# EAGLE design V1 (EAGLE 7.6.0)
Tek 7904A LED graticule illumination mod
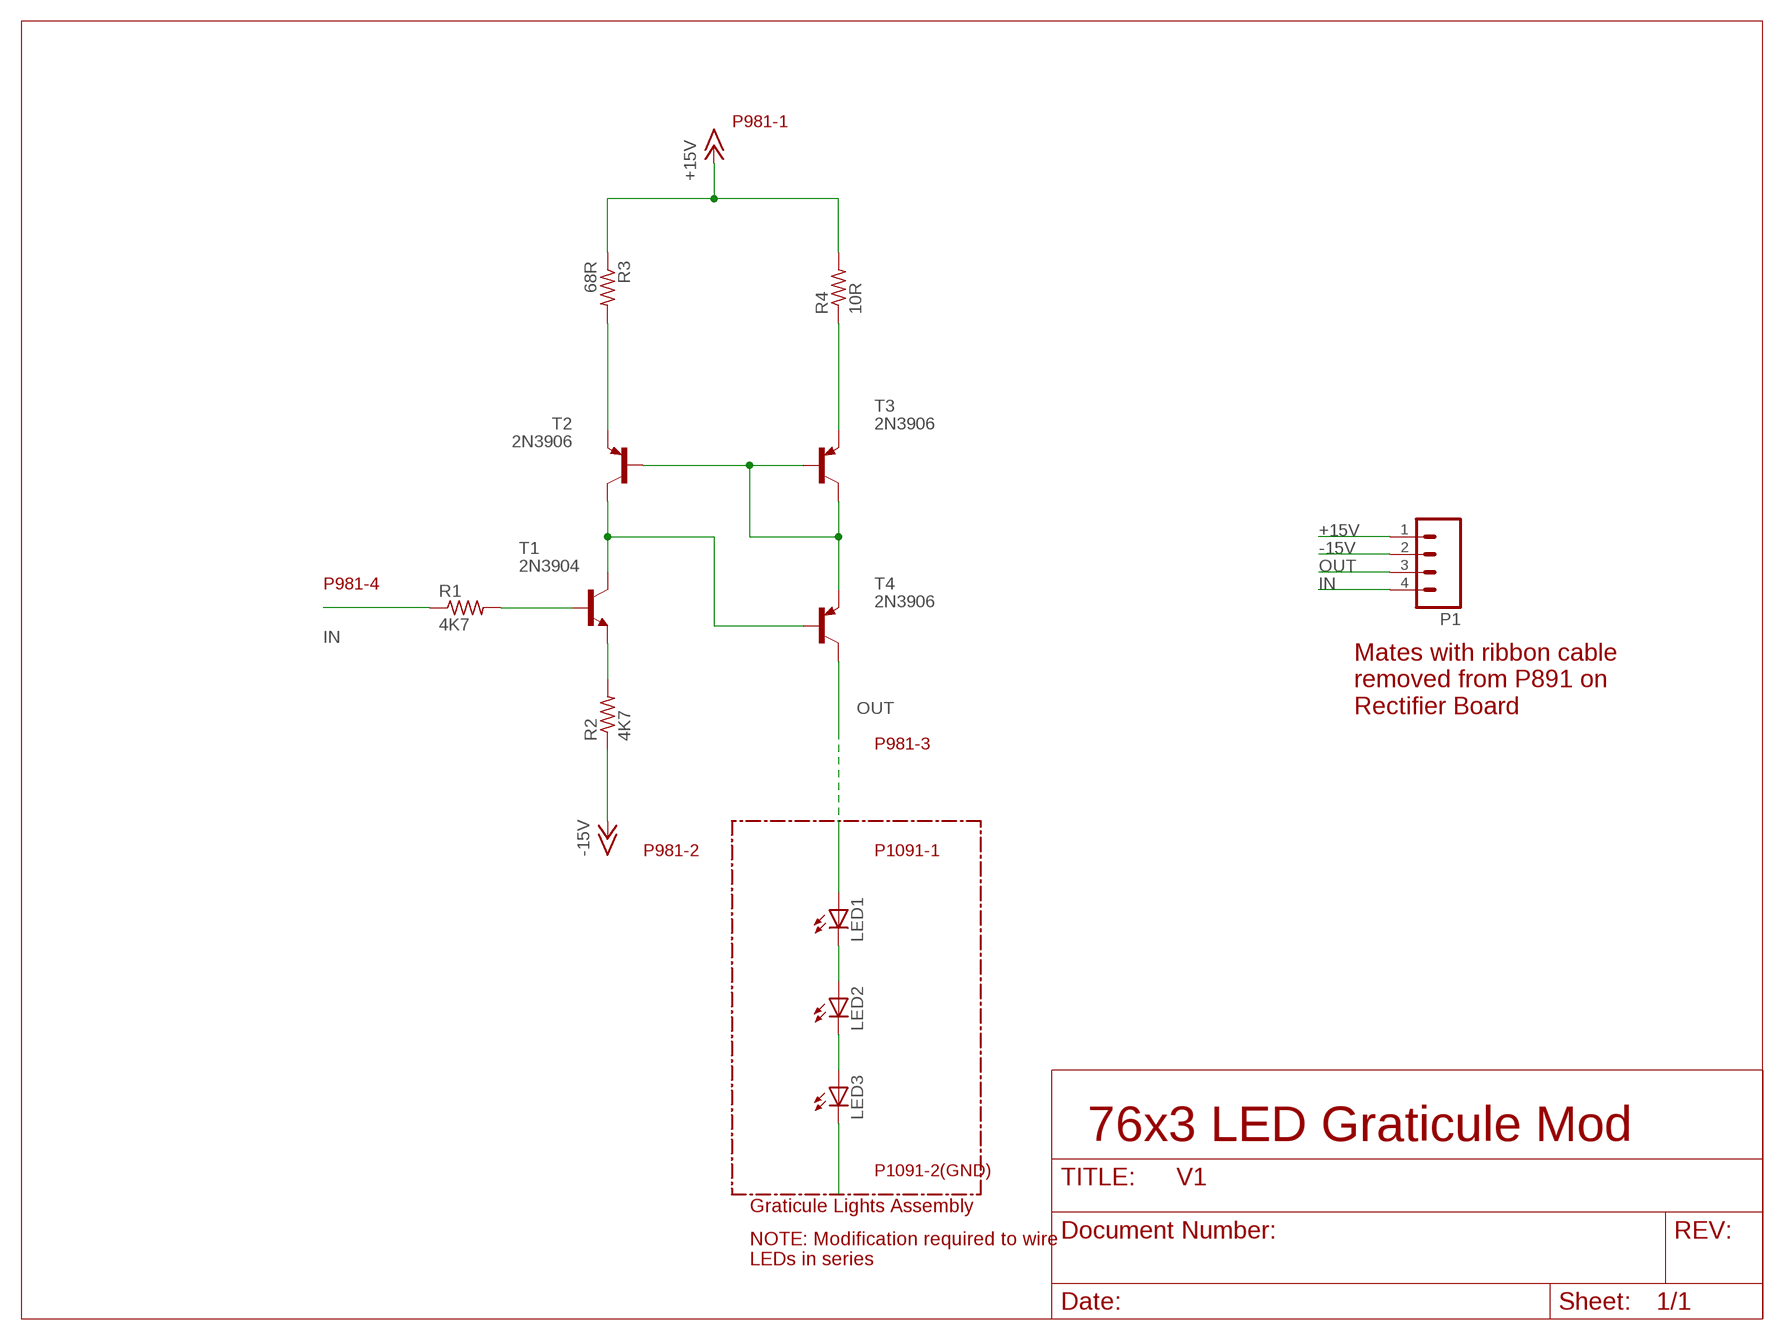
[diagram p0: schematic, sheet 1]

## Parts
LED1  LED5MM  [LED5MM]
LED2  LED5MM  [LED5MM]
LED3  LED5MM  [LED5MM]
P1  M04PTH  [1X04]
R1  4K7  R-US_0309/V  [0309V]
R2  4K7  R-US_0309/V  [0309V]
R3  68R  R-US_0309/V  [0309V]
R4  10R  R-US_0309/V  [0309V]
T1  2N3904  -NPN-TO92-EBC  [TO92-EBC]
T2  2N3906  BC328-PNP-TO92-EBC  [TO92-EBC]
T3  2N3906  BC328-PNP-TO92-EBC  [TO92-EBC]
T4  2N3906  BC328-PNP-TO92-EBC  [TO92-EBC]

## Nets
+15V [Supply]: P1.1 R3.1 R4.2
-15V: P1.2 R2.1
IN: P1.4 R1.1
N$1: R1.2 T1.B
N$2: LED3.K(C)
N$3: R2.2 T1.E
N$5: R3.2 T2.E
N$7: LED2.K(C) LED3.A
N$8: LED1.K(C) LED2.A
N$9: LED1.A
N$10 [Supply]: R4.1 T3.E
N$11 [Supply]: T2.B T3.B T3.C T4.E
N$13: T1.C T2.C T4.B
OUT [Supply]: P1.3 T4.C

## Notes on the sheet
- P981-1
- P981-4
- Mates with ribbon cable
  removed from P891 on
  Rectifier Board
- P981-3
- P981-2 | P1091-1
- 76x3 LED Graticule Mod
- P1091-2(GND)
- Graticule Lights Assembly
- NOTE: Modification required to wire
  LEDs in series

## Library data of the parts
LED1-LED3 = led:LED: LED OSRAM: - CHIPLED LG R971, LG N971, LY N971, LG Q971, LY Q971, LO R971, LY R971 LH N974, LH R974 LS Q976, LO Q976, LY Q976 LO Q996 - Hyper CHIPLED LW Q18S LB Q993, LB Q99A, LB R99A - SideLED LS A670, LO A670, LY A670, LG A670, LP A670 LB A673, LV A673, LT A673, LW A673 LH A674 LY A675 LS A676, LA A676, LO A676, LY A676, LW A676 LS A679, LY A679, LG A679 - Hyper Micro SIDELED® LS Y876, LA Y876, LO Y876, LY Y876 LT Y87S - SmartLED LW L88C, LW L88S LB L89C, LB L89S, LG L890 LS L89K, LO L89K, LY L89K LS L896, LA L896, LO L896, LY L896 - TOPLED LS T670, LO T670, LY T670, LG T670, LP T670 LSG T670, LSP T670, LSY T670, LOP T670, LYG T670 LG T671, LOG T671, LSG T671 LB T673, LV T673, LT T673, LW T673 LH T674 LS T676, LA T676, LO T676, LY T676, LB T676, LH T676, LSB T676, LW T676 LB T67C, LV T67C, LT T67C, LS T67K, LO T67K, LY T67K, LW E67C LS E67B, LA E67B, LO E67B, LY E67B, LB E67C, LV E67C, LT E67C LW T67C LS T679, LY T679, LG T679 LS T770, LO T770, LY T770, LG T770, LP T770 LB T773, LV T773, LT T773, LW T773 LH T774 LS E675, LA E675, LY E675, LS T675 LS T776, LA T776, LO T776, LY T776, LB T776 LHGB T686 LT T68C, LB T68C - Hyper Mini TOPLED® LB M676 - Mini TOPLED Santana® LG M470 LS M47K, LO M47K, LY M47K Source: http://www.osram.convergy.de LUXEON: - LUMILED® LXK2-PW12-R00, LXK2-PW12-S00, LXK2-PW14-U00, LXK2-PW14-V00 LXK2-PM12-R00, LXK2-PM12-S00, LXK2-PM14-U00 LXK2-PE12-Q00, LXK2-PE12-R00, LXK2-PE12-S00, LXK2-PE14-T00, LXK2-PE14-U00 LXK2-PB12-K00, LXK2-PB12-L00, LXK2-PB12-M00, LXK2-PB14-N00, LXK2-PB14-P00, LXK2-PB14-Q00 LXK2-PR12-L00, LXK2-PR12-M00, LXK2-PR14-Q00, LXK2-PR14-R00 LXK2-PD12-Q00, LXK2-PD12-R00, LXK2-PD12-S00 LXK2-PH12-R00, LXK2-PH12-S00 LXK2-PL12-P00, LXK2-PL12-Q00, LXK2-PL12-R00 Source: www.luxeon.com KINGBRIGHT: KA-3528ASYC Source: www.kingbright.com
P1 = SparkFun-Connectors:M04: Header 4 Standard 4-pin 0.1" header. Use with straight break away headers (SKU : PRT-00116), right angle break away headers (PRT-00553), swiss pins (PRT-00743), machine pins (PRT-00117), and female headers (PRT-00115). Molex polarized connector foot print use with SKU : PRT-08231 with associated crimp pins and housings. 1MM SMD Version SKU: PRT-10208
R1-R4 = rcl:R-US_: RESISTOR, American symbol
T1 = transistor:*-NPN-: NPN Transistror BF959 corrected 2008.03.06
T2-T4 = transistor:*-PNP-: PNP Transistror

## Net classes
1 Supply: width 0.508 mm

## Board
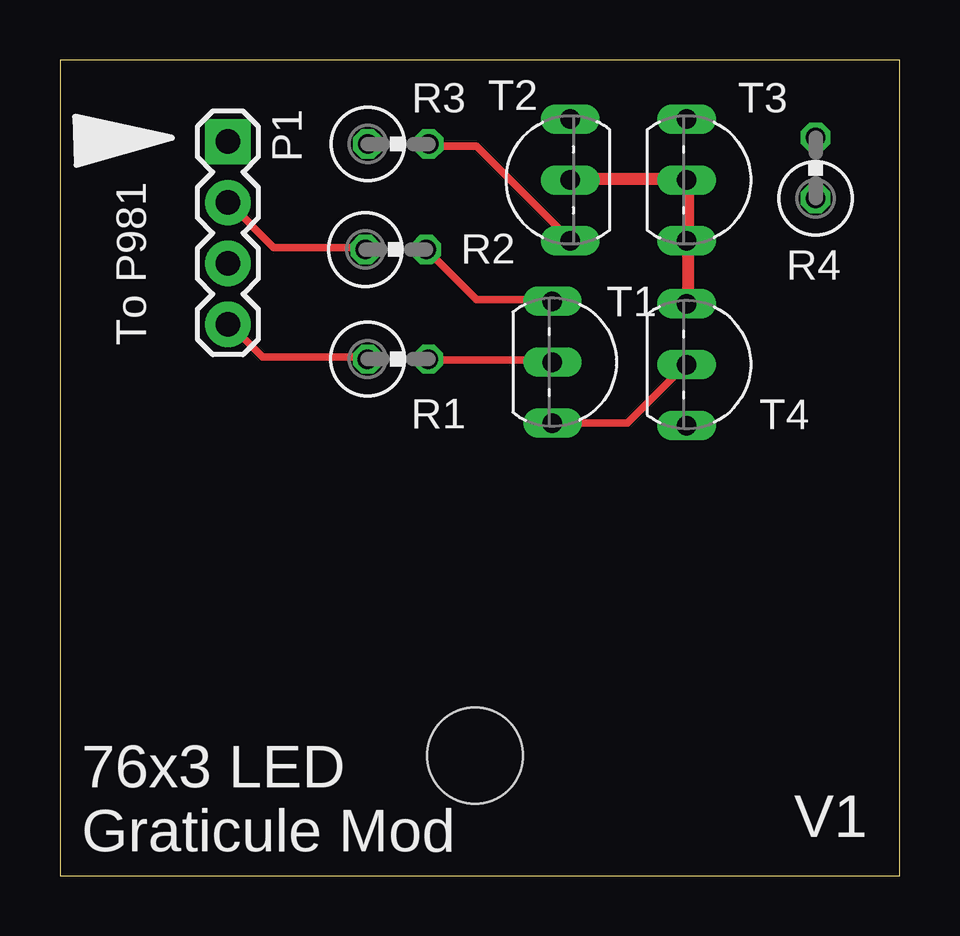
[diagram p1: board, top side]
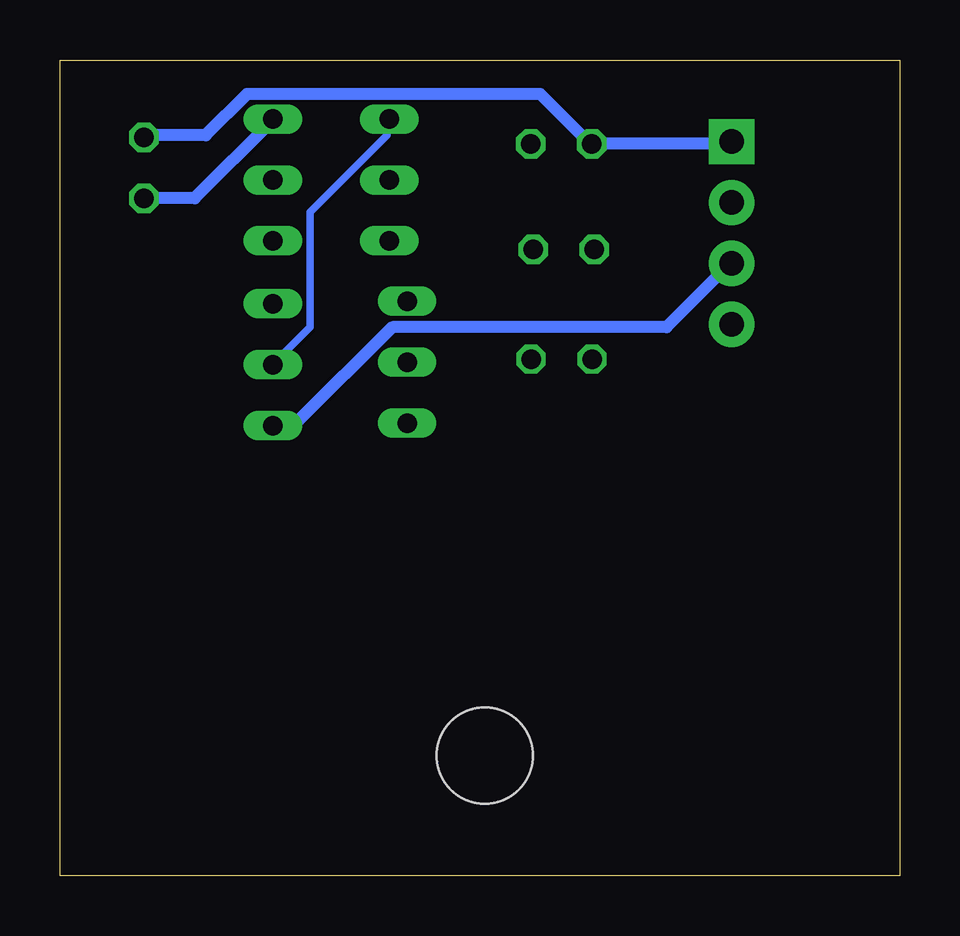
[diagram p2: board, bottom side, seen from below]

Size 35 x 34 mm. Coordinates in mm from the lower left corner, seen from the top.
Outline: 0,0 35,0 35,34 0,34 0,0
Copper layers (1*16): Top 0.035559375mm / dielectric 1.6mm / Bottom 0.035559375mm
Design rules "oshpark-2layer *": minimum track width 12mil, minimum drill 10mil, track to track 6mil, track to pad 6mil, pad to pad 6mil, via to via 6mil, smd to smd 6mil, copper to edge 15mil, drill to drill 6mil, minimum pad ring 5mil, minimum via ring 5mil, stop-mask expansion 2.5mil, vias tented up to drill 0mil, thermal gap 10mil
Holes 4 mm at 17.3,5
tKeepout: area 0,-16 to 35,6
bKeepout: area 0,-16 to 35,6

### Footprints (pad centres in the part's own frame; a part is rotated, then mirrored left to right if it is on the bottom)
LED5MM = drill 0.813 octagon: A -1.27,0; K 1.27,0
1X04 = drill 1.016 pad 1.88 square: 1 0,0 | drill 1.016 pad 1.88: 2 2.54,0; 3 5.08,0; 4 7.62,0
0309V = drill 0.813 octagon: 1 -1.27,0; 2 1.27,0
TO92-EBC = drill 0.813 long: B 0,-1.27; C 2.54,-1.27; E -2.54,-1.27

### Placement (x,y rotation side)
LED1  3.1,-19.6 0 top  (outside the outline)
LED2  3.1,-26.3 0 top  (outside the outline)
LED3  3.1,-33 0 top  (outside the outline)
P1  7,30.6 270 top
R1  14.09,21.53 0 top
R2  14,26.1 0 top
R3  14.1,30.5 0 top
R4  31.5,29.5 90 top
T1  21.8,21.4 270 top
T2  20,29 90 top
T3  27.4,29 270 top
T4  27.4,21.3 270 top

### Tracks (layer width: path | path; a pad name or v marks a point on that pad's centre or on a via)
+15V
  Bottom 0.508: P1.1 7.09,30.52 12.8,30.52 R3.1 13.03,30.63 14.97,32.58 27.2,32.58 28.92,30.86 31.43,30.86 R4.2
-15V
  Top 0.305: R2.1 12.69,26.18 8.91,26.18 7.09,28.01 P1.2
IN
  Top 0.305: R1.1 12.8,21.6 8.46,21.6 7.09,22.98 P1.4
N$1
  Top 0.305: T1.B 20.46,21.49 15.43,21.49 R1.2
N$3
  Top 0.305: T1.E 20.46,24.01 17.37,24.01 15.32,26.06 R2.2
N$5
  Top 0.305: R3.2 15.43,30.41 17.37,30.41 21.26,26.52 T2.E
N$7  (1 unrouted)
N$8  (1 unrouted)
N$10
  Bottom 0.508: R4.1 31.43,28.23 29.38,28.23 26.18,31.43 T3.E
N$11
  Top 0.508: T4.E 26.18,23.89 26.18,26.41 T3.C 26.18,26.63 26.18,28.81 T3.B 26.06,29.03 21.37,29.03 T2.B
N$13
  Top 0.305: T1.C 20.57,18.86 23.66,18.86 26.06,21.26 T4.B
  Bottom 0.305: T2.C 21.37,31.43 21.37,30.86 24.57,27.66 24.57,22.86 26.06,21.38 T4.B
OUT
  Bottom 0.508: T4.C 26.06,18.86 25.15,18.86 21.14,22.86 9.72,22.86 7.09,25.49 P1.3

### Text on the board
tPlace: To P981
tNames: V1 | 76x3 LED / Graticule Mod
tValues: V3